# EAGLE design NeoGeo JAMMA OD (EAGLE 9.6.2)
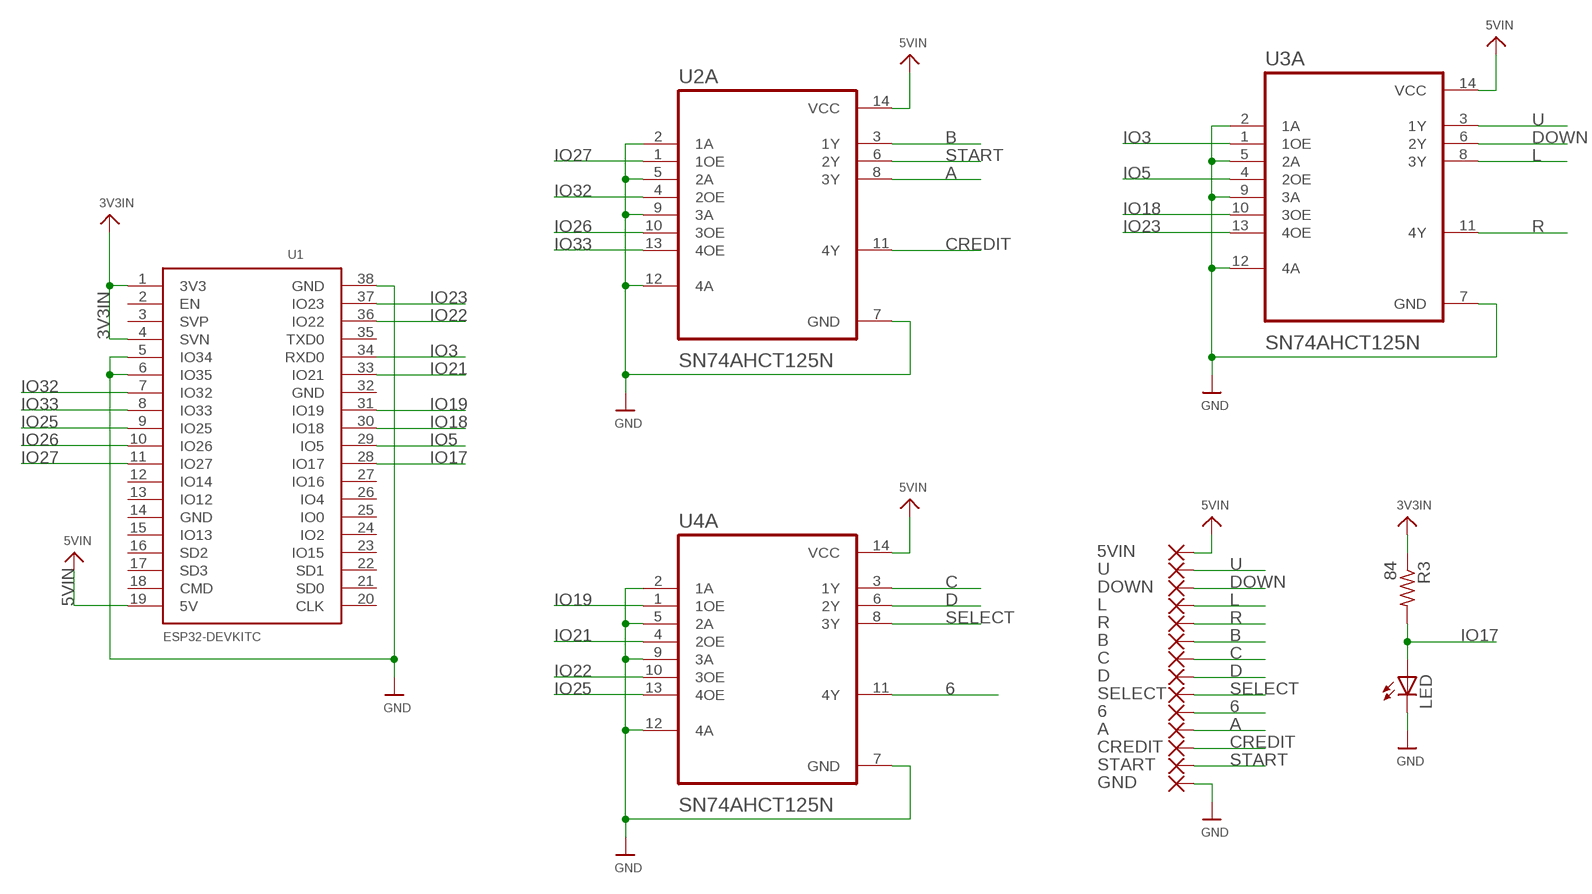
[diagram p0: schematic, sheet 1]

## Parts
5VIN  SMD5  [SMD2,54-5,08]
6  SMD5  [SMD2,54-5,08]
A  SMD5  [SMD2,54-5,08]
B  SMD5  [SMD2,54-5,08]
C  SMD5  [SMD2,54-5,08]
CREDIT  SMD5  [SMD2,54-5,08]
D  SMD5  [SMD2,54-5,08]
DOWN  SMD5  [SMD2,54-5,08]
GND  SMD5  [SMD2,54-5,08]
L  SMD5  [SMD2,54-5,08]
LED  LEDCHIPLED_1206  [CHIPLED_1206]
R  SMD5  [SMD2,54-5,08]
R3  84  R-US_R1206  [R1206]
SELECT  SMD5  [SMD2,54-5,08]
START  SMD5  [SMD2,54-5,08]
U  SMD5  [SMD2,54-5,08]
U1  ESP32DEVKITC  [ESP32-DEVKITC]
U2A  SN74AHCT125N  [DIP794W45P254L1969H508Q14]
U3A  SN74AHCT125N  [DIP794W45P254L1969H508Q14]
U4A  SN74AHCT125N  [DIP794W45P254L1969H508Q14]

## Nets
3V3IN: R3.1 U1.1(3V3) U1.4(SVN)
5VIN: 5VIN.1(P) U1.19(5V) U2A.14(VCC) U3A.14(VCC) U4A.14(VCC)
6: 6.1(P) U4A.11(4Y)
A: A.1(P) U2A.8(3Y)
B: B.1(P) U2A.3(1Y)
C: C.1(P) U4A.3(1Y)
CREDIT: CREDIT.1(P) U2A.11(4Y)
D: D.1(P) U4A.6(2Y)
DOWN: DOWN.1(P) U3A.6(2Y)
GND: GND.1(P) LED.C U1.5(IO34) U1.6(IO35) U1.38(GND) U2A.2(1A) U2A.5(2A) U2A.7(GND) U2A.9(3A) U2A.12(4A) U3A.2(1A) U3A.5(2A) U3A.7(GND) U3A.9(3A) U3A.12(4A) U4A.2(1A) U4A.5(2A) U4A.7(GND) U4A.9(3A) U4A.12(4A)
IO3: U1.34(RXD0) U3A.1(1OE)
IO5: U1.29(IO5) U3A.4(2OE)
IO17: LED.A R3.2 U1.28(IO17)
IO18: U1.30(IO18) U3A.10(3OE)
IO19: U1.31(IO19) U4A.1(1OE)
IO21: U1.33(IO21) U4A.4(2OE)
IO22: U1.36(IO22) U4A.10(3OE)
IO23: U1.37(IO23) U3A.13(4OE)
IO25: U1.9(IO25) U4A.13(4OE)
IO26: U1.10(IO26) U2A.10(3OE)
IO27: U1.11(IO27) U2A.1(1OE)
IO32: U1.7(IO32) U2A.4(2OE)
IO33: U1.8(IO33) U2A.13(4OE)
L: L.1(P) U3A.8(3Y)
R: R.1(P) U3A.11(4Y)
SELECT: SELECT.1(P) U4A.8(3Y)
START: START.1(P) U2A.6(2Y)
U: U3A.3(1Y) U.1(P)
Unconnected: U1.2(EN) U1.3(SVP) U1.12(IO14) U1.13(IO12) U1.14(GND) U1.15(IO13) U1.16(SD2) U1.17(SD3) U1.18(CMD) U1.20(CLK) U1.21(SD0) U1.22(SD1) U1.23(IO15) U1.24(IO2) U1.25(IO0) U1.26(IO4) U1.27(IO16) U1.32(GND) U1.35(TXD0)

## Library data of the parts
5VIN 6 A B C CREDIT D DOWN GND L R SELECT START U = wirepad:SMD5: SMD PAD
LED = adafruit:LED: LED OSRAM: - CHIPLED LG R971, LG N971, LY N971, LG Q971, LY Q971, LO R971, LY R971 LH N974, LH R974 LS Q976, LO Q976, LY Q976 LO Q996 - Hyper CHIPLED LW Q18S LB Q993, LB Q99A, LB R99A - SideLED LS A670, LO A670, LY A670, LG A670, LP A670 LB A673, LV A673, LT A673, LW A673 LH A674 LY A675 LS A676, LA A676, LO A676, LY A676, LW A676 LS A679, LY A679, LG A679 - Hyper Micro SIDELED® LS Y876, LA Y876, LO Y876, LY Y876 LT Y87S - SmartLED LW L88C, LW L88S LB L89C, LB L89S, LG L890 LS L89K, LO L89K, LY L89K LS L896, LA L896, LO L896, LY L896 - TOPLED LS T670, LO T670, LY T670, LG T670, LP T670 LSG T670, LSP T670, LSY T670, LOP T670, LYG T670 LG T671, LOG T671, LSG T671 LB T673, LV T673, LT T673, LW T673 LH T674 LS T676, LA T676, LO T676, LY T676, LB T676, LH T676, LSB T676, LW T676 LB T67C, LV T67C, LT T67C, LS T67K, LO T67K, LY T67K, LW E67C LS E67B, LA E67B, LO E67B, LY E67B, LB E67C, LV E67C, LT E67C LW T67C LS T679, LY T679, LG T679 LS T770, LO T770, LY T770, LG T770, LP T770 LB T773, LV T773, LT T773, LW T773 LH T774 LS E675, LA E675, LY E675, LS T675 LS T776, LA T776, LO T776, LY T776, LB T776 LHGB T686 LT T68C, LB T68C - Hyper Mini TOPLED® LB M676 - Mini TOPLED Santana® LG M470 LS M47K, LO M47K, LY M47K Source: http://www.osram.convergy.de/
R3 = adafruit:R-US_: RESISTOR, American symbol
U1 = ESP32-DEVKITC4:ESP32DEVKITC
U2A U3A U4A = SN74AHCT125N:SN74AHCT125N: None Check prices <https://pricing.snapeda.com/parts/SN74AHCT125N/Texas%20Instruments/view-part?ref=eda>; AVAILABILITY: In Stock; DESCRIPTION: Quadruple Bus Buffer Gates With 3-State Outputs 14-PDIP -40 to 125; MF: Texas Instruments; MP: SN74AHCT125N; PACKAGE: PDIP-14 Texas Instruments; PRICE: None; PURCHASE-URL: https://pricing.snapeda.com/search/part/SN74AHCT125N/?ref=eda

## Board
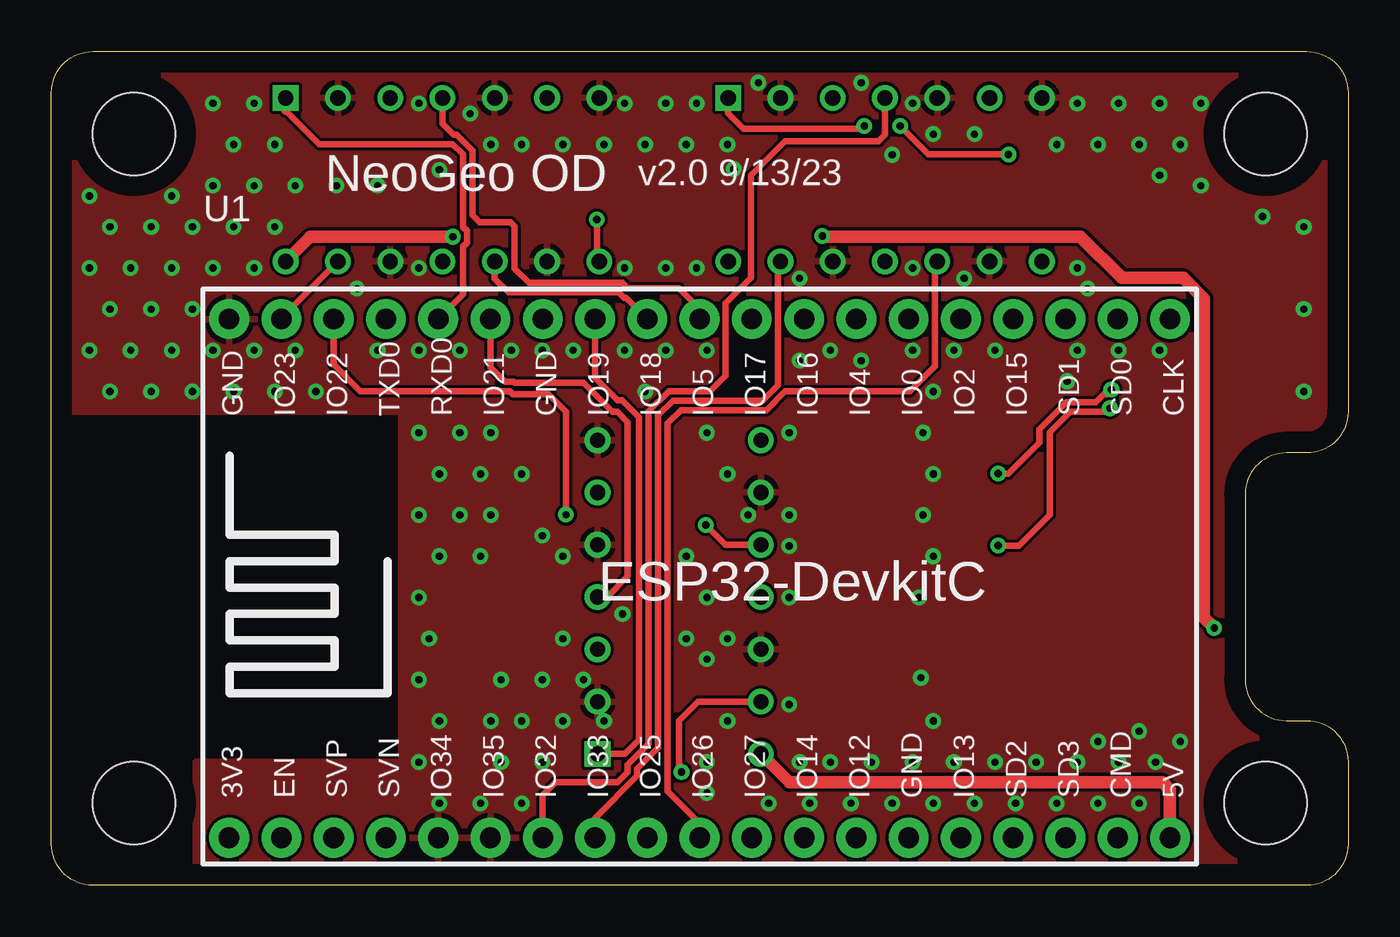
[diagram p1: board, top side]
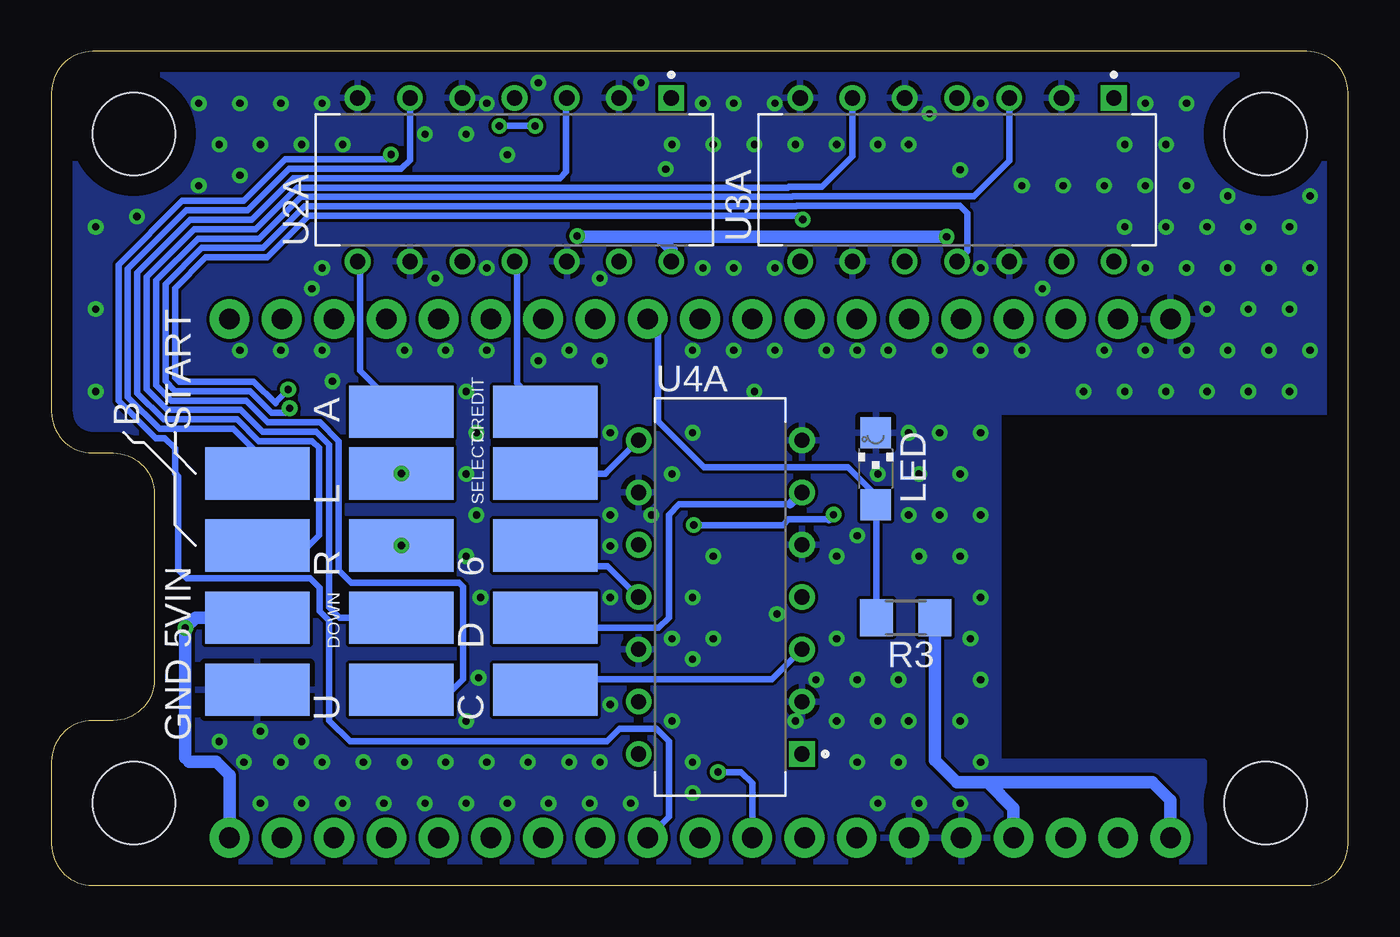
[diagram p2: board, bottom side, seen from below]

Size 63 x 40.5 mm. Coordinates in mm from the lower left corner, seen from the top.
Outline: 0,2 0,38.5 arc-90 2,40.5 61,40.5 arc-90 63,38.5 63,23 arc-90 61,21 60,21 arc90 58,19 58,10 arc90 60,8 61,8 arc-90 63,6 63,2 arc-90 61,0 2,0 arc-90 0,2
Copper layers (1*16): Top 0.035mm / dielectric 1.5mm / Bottom 0.035mm
Design rules "default": minimum track width 6mil, minimum drill 0.35mm, track to track 6mil, track to pad 6mil, pad to pad 6mil, via to via 6mil, smd to smd 6mil, copper to edge 40mil, drill to drill 6mil, minimum pad ring 10mil, minimum via ring 8mil, stop-mask expansion 4mil, vias tented up to drill 0.5mm, thermal gap 10mil
Holes 4 mm at 4,4 4,36.5 59,36.5 59,4

### Footprints (pad centres in the part's own frame; a part is rotated, then mirrored left to right if it is on the bottom)
SMD2,54-5,08 = smd 2.54 x 5.08: 1 0,0
CHIPLED_1206 = smd 1.5 x 1.5: A 0,-1.75; C 0,1.75
R1206 = smd 1.6 x 1.803: 1 -1.422,0; 2 1.422,0
ESP32-DEVKITC = drill 1 pad 1.93: 1 -22.87,-12.69; 2 -20.33,-12.69; 3 -17.79,-12.69; 4 -15.25,-12.69; 5 -12.71,-12.69; 6 -10.17,-12.69; 7 -7.63,-12.69; 8 -5.09,-12.69; 9 -2.55,-12.69; 10 -0.01,-12.69; 11 2.53,-12.69; 12 5.07,-12.69; 13 7.61,-12.69; 14 10.15,-12.69; 15 12.69,-12.69; 16 15.23,-12.69; 17 17.77,-12.69; 18 20.31,-12.69; 19 22.85,-12.69; 20 22.85,12.5; 21 20.31,12.5; 22 17.77,12.5; 23 15.23,12.5; 24 12.69,12.5; 25 10.15,12.5; 26 7.61,12.5; 27 5.07,12.5; 28 2.53,12.5; 29 -0.01,12.5; 30 -2.55,12.5; 31 -5.09,12.5; 32 -7.63,12.5; 33 -10.17,12.5; 34 -12.71,12.5; 35 -15.25,12.5; 36 -17.79,12.5; 37 -20.33,12.5; 38 -22.87,12.5
DIP794W45P254L1969H508Q14 = drill 0.74 pad 1.14 square: 1 -3.97,7.62 | drill 0.74 pad 1.14: 2 -3.97,5.08; 3 -3.97,2.54; 4 -3.97,0; 5 -3.97,-2.54; 6 -3.97,-5.08; 7 -3.97,-7.62; 8 3.97,-7.62; 9 3.97,-5.08; 10 3.97,-2.54; 11 3.97,0; 12 3.97,2.54; 13 3.97,5.08; 14 3.97,7.62

### Placement (x,y rotation side)
5VIN  53,13 270 bottom
6  39,16.5 270 bottom
A  46,23 90 bottom
B  53,16.5 270 bottom
C  39,9.5 270 bottom
CREDIT  39,23 90 bottom
D  39,13 270 bottom
DOWN  46,13 270 bottom
GND  53,9.5 270 bottom
L  46,20 270 bottom
LED  22.95,20.24 0 bottom
R  46,16.5 270 bottom
R3  21.5,13 180 bottom
SELECT  39,20 270 bottom
START  53,20 90 bottom
U  46,9.5 270 bottom
U1  31.5,15 0 top
U2A  40.5,34.27 270 bottom
U3A  19,34.27 270 bottom
U4A  30.5,14 180 bottom

### Tracks (layer width: path | path; a pad name or v marks a point on that pad's centre or on a via)
3V3IN
  Bottom 0.61: R3.1 20.08,6.08 19,5 17.5,5 | 17.5,5 9.5,5 8.63,4.13 U1.1 | 17.5,5 16.25,3.75 U1.4
5VIN  (via drill 0.35)
  Top 0.61: U4A.14 35.85,5 54,5 54.35,4.65 U1.19 | v37.46,31.54 37.5,31.5 50,31.5 52,29.5 55,29.5 56,28.5 56,13 v56.5,12.5 | v19.5,31.5 12.58,31.5 U3A.14
  Bottom 0.61: 5VIN.1 56,13 v56.5,12.5 56.5,6.2 56.3,6 55,6 54.35,5.35 U1.19 | v19.5,31.5 33.5,31.5 | 33.5,31.5 37.42,31.5 v37.46,31.54 | U2A.14 32.88,30.88 33.5,31.5
6
  Bottom 0.305: U4A.11 35.97,15.5 38,15.5 6.1
A
  Bottom 0.305: A.1 48,25 48,30.18 U2A.8
B
  Bottom 0.305: 38,38.31 38,34.65 38.3,34.35 51.26,34.35 53.27,32.33 56.26,32.33 58.83,29.76 58.83,23.9 57.56,22.63 53.98,22.63 52.93,21.57 50.33,21.57 50,21.24 50,17 50.5,16.5 B.1
  Bottom 0.406: U2A.3 38,38.31
C
  Bottom 0.305: U4A.3 27.99,10 38,10 38.5,9.5 C.1
CREDIT
  Bottom 0.305: CREDIT.1 40.38,24.38 40.38,30.18 U2A.11
D
  Bottom 0.305: 27.11,18.5 32.5,18.5 33,18 33,13 33.5,12.5 38.5,12.5 D.1
  Bottom 0.406: U4A.6 27.11,18.5
DOWN
  Bottom 0.305: U3A.6 24.08,35.42 25.57,33.93 27.16,33.93 27.2,33.89 51.07,33.89 53.09,31.87 56.07,31.87 58.37,29.57 58.37,24.09 57.37,23.09 53.8,23.09 52.74,22.03 50.14,22.03 49.5,21.39 49.5,13.5 49,13 DOWN.1
GND  (via drill 0.35)
  other vias: 18.85,34.75 2.85,23.98 1.85,25.98 2.85,27.98 1.85,29.98 2.85,31.98 1.85,33.48 4.85,23.98 3.85,25.98 4.85,27.98 3.85,29.98 4.85,31.98 6.85,23.98 5.85,25.98 6.85,27.98 5.85,29.98 6.85,31.98 5.85,33.48 8.85,23.98 7.85,25.98 7.85,29.98 8.85,31.98 7.85,33.98 8.85,35.98 7.85,37.98 10.85,23.98 9.85,25.98 9.85,29.98 10.85,31.98 9.85,33.98 10.85,35.98 9.85,37.98 12.85,23.98 11.85,25.98 11.85,33.98 14.85,28.98 13.85,33.98 15.85,25.98 15.85,33.98 18.85,3.98 17.85,5.98 18.85,7.98 17.85,9.98 18.35,11.98 17.85,13.98 18.85,15.98 17.85,17.98 18.85,19.98 17.85,21.98 17.85,25.98 17.85,29.98 17.85,37.98 20.85,3.98 21.35,7.98 20.85,15.98 19.85,17.98 20.85,19.98 19.85,21.98 19.85,25.98 21.35,35.98 20.35,37.48 22.85,3.98 21.85,5.98 22.85,7.98 21.85,9.98 21.35,17.98 22.85,19.98 21.35,21.98 22.35,25.98 22.85,35.98 23.85,5.98 24.85,7.98 23.85,9.98 24.85,11.98 24.85,15.98 23.85,16.98 23.85,25.98 24.85,35.98 26.85,7.98 25.85,9.98 25.35,25.98 26.85,35.98 27.75,13.18 28.85,23.98 27.85,25.98 27.85,29.98 28.85,35.98 27.85,37.98 30.85,11.98 30.85,15.98 29.85,25.98 29.85,29.98 30.85,35.98 29.85,37.98 31.85,5.98 32.85,7.98 32.85,11.98 31.85,13.98 32.85,19.98 31.85,21.98 31.85,25.98 31.35,29.98 32.85,35.98 31.35,37.98 34.85,3.98 33.85,17.98 35.85,16.48 33.15,34.78 34.35,38.98 36.85,3.98 36.35,5.98 35.85,8.78 35.85,13.98 35.85,17.98 35.85,21.98 36.35,25.48 38.85,3.98 37.85,5.98 31.85,10.98 37.85,25.98 36.35,29.48 39.35,38.98 40.85,3.98 39.85,5.98 31.85,4.48 39.35,25.48 40.85,35.48 42.85,3.98 41.85,5.98 42.85,7.98 42.25,10.08 42.15,13.98 42.85,15.98 42.35,17.98 42.85,19.98 42.35,21.98 42.85,23.98 41.85,25.98 41.85,29.98 42.85,36.48 41.85,37.98 44.85,3.98 43.85,5.98 54.85,6.98 43.85,25.98 44.35,29.48 44.85,36.48 46.85,3.98 45.85,5.98 50.85,6.98 45.85,25.98 48.85,3.98 47.85,5.98 49.35,24.48 48.85,35.98 50.85,3.98 49.85,5.98 49.85,25.98 49.85,29.98 50.85,35.98 49.85,37.98 52.85,3.98 51.85,5.98 52.85,7.48 51.85,25.98 50.35,28.98 52.85,35.98 51.85,37.98 53.65,5.98 53.85,25.98 53.85,34.48 54.85,35.98 53.85,37.98 55.85,33.98 55.85,37.98 58.85,32.48 60.85,23.98 60.85,27.98 60.85,31.98
  pour Bottom: 7,0 63,0 63,40.5 0,40.5 0,23 17,23 17,6 7,6
  pour Top: 0,40.5 0,23 17,23 17,6 7,6 7,0 63,0 63,40.5
IO3
  Top 0.305: 11.38,37.62 13,36 19,36 19.5,36 20,35.5 20,31.97 20.18,31.78 20.18,31.22 20,31.03 20,28.71 U1.34
  Top 0.406: U3A.1 11.38,37.62
IO5
  Top 0.305: U3A.4 19,37 19.54,36.46 19.69,36.46 20.46,35.69 20.46,32.54 20.8,32.2 22.3,32.2 22.5,32 22.5,29.96 23.2,29.26 27.74,29.26 28,29 30.5,29 31.49,28.01 U1.29
IO17
  Bottom 0.305: R3.2 22.92,18.46 LED.A 22.97,18.59 22.97,18.97 24.3,20.3 31.3,20.3 33.53,22.53 33.53,27 U1.28
IO18
  Top 0.305: U3A.10 21.54,29.46 22.2,28.8 27.55,28.8 27.81,28.54 27.91,28.54 U1.30
IO19
  Top 0.305: U4A.1 27.88,6.38 28.56,7.06 28.56,22.73 27.73,23.56 27.5,23.56 26.41,24.65 U1.31
IO21
  Top 0.305: 27,14 28,15 28,22.5 27.5,23 27.27,23 25.86,24.41 22.51,24.41 22.46,24.46 22.04,24.46 21.33,25.17 U1.33
  Top 0.406: U4A.4 27,14
IO22  (via drill 0.35)
  Top 0.305: U4A.10 32.75,16.54 v31.79,17.5 | v25,18 25,23 24.15,23.85 22.42,23.85 22.27,24 15,24 13.75,25.25 13.71,25.29 U1.36
  Bottom 0.305: v31.79,17.5 27.46,17.5 27.18,17.78 25.22,17.78
  Bottom 0.406: 25.22,17.78 v25,18
IO23
  Top 0.305: U3A.13 11.17,27.55 U1.37
IO25  (via drill 0.35)
  Top 0.305: v30.61,5.5 30.5,5.61 30.5,8 31.42,8.92 U4A.13
  Bottom 0.305: v30.61,5.5 29.5,5.5 28.95,4.95 U1.9
IO26
  Top 0.305: U2A.10 42.92,30.18 42.92,25.2 41.72,24 35.65,24 34.73,23.09 30.59,23.09 29.93,22.43 29.93,4.57 31.49,3.01 U1.10
IO27  (via drill 0.35)
  Top 0.305: U2A.1 32.88,37.49 33.62,36.75 39.37,36.75 v39.5,36.88 | v41.23,36.88 42.62,35.5 v46.5,35.5
  Bottom 0.305: v41.23,36.88 v39.5,36.88 | v46.5,35.5 46.74,35.26 51.64,35.26 53.65,33.24 56.64,33.24 59.74,30.14 59.74,23.52 57.94,21.72 57.5,21.72 57,21.22 57,20.02 56.83,19.85 56.83,15.33 56.42,14.93 50.42,14.93 49.96,14.46 49.96,13.31 49.5,12.85 49.5,8 48.5,7 36,7 35.4,7.6 33.6,7.6 33,7 33,3.34 U1.11
IO32
  Top 0.305: U2A.4 40.5,36.46 40.19,36.15 35.65,36.15 34,34.5 34,29.5 32.76,28.26 32.76,24.76 32,24 30,24 29.02,23.02 29.02,6.87 28,5.85 28,5.5 27.5,5 24.5,5 23.87,4.37 U1.7
IO33
  Top 0.305: U1.8 26.41,3.26 28.46,5.31 28.46,5.66 29.47,6.68 29.47,22.83 30.19,23.54 34.54,23.54 35.3,24.3 35.3,30.18 U2A.13
L  (via drill 0.35)
  Top 0.305: U3A.8 26.5,30.42 v26.5,32.34 | v51.5,24.08 51.27,23.86 51.15,23.86 50.75,23.46 49.31,23.46 48,22.15 48,21.5 46.5,20 L.1
  Bottom 0.305: v26.5,32.34 26.56,32.34 26.75,32.52 50.5,32.52 52.52,30.5 55.5,30.5 57,29 57,24.66 56.8,24.46 53.17,24.46 52.11,23.4 52.11,23.45 51.5,24.07 v51.5,24.08
  other vias: 46,20
R  (via drill 0.35)
  Top 0.305: v51.43,23.17 51.26,23 49.5,23 48.5,22 48.5,18 47,16.5 R.1
  Bottom 0.305: U3A.11 18.5,30.8 18.5,32.65 18.86,33.02 26.78,33.02 26.83,32.98 50.69,32.98 52.71,30.96 55.69,30.96 57.46,29.19 57.46,24.47 56.99,24 53.36,24 52.3,22.95 51.65,22.95 v51.43,23.17
  other vias: 46,16.5
SELECT
  Bottom 0.305: U4A.8 36.05,20.05 36.09,20 SELECT.1
START
  Bottom 0.305: U2A.6 45.58,35.22 46,34.8 51.45,34.8 53.46,32.79 56.45,32.79 59.29,29.95 59.29,23.71 57.75,22.17 54.17,22.17 53,21 START.1
U
  Bottom 0.305: U3A.3 16.46,35.19 18.18,33.48 26.97,33.48 27.02,33.43 50.88,33.43 52.9,31.41 55.88,31.41 57.91,29.38 57.91,24.28 57.18,23.55 53.55,23.55 52.49,22.49 49.95,22.49 49.04,21.58 49.04,15.3 48.44,14.7 43.2,14.7 43,14.5 43,10 43.5,9.5 U.1

### Text on the board
tPlace: NeoGeo OD | v2.0 9/13/23